# Altium project FEED_TIMER_DP_7.PrjPcb
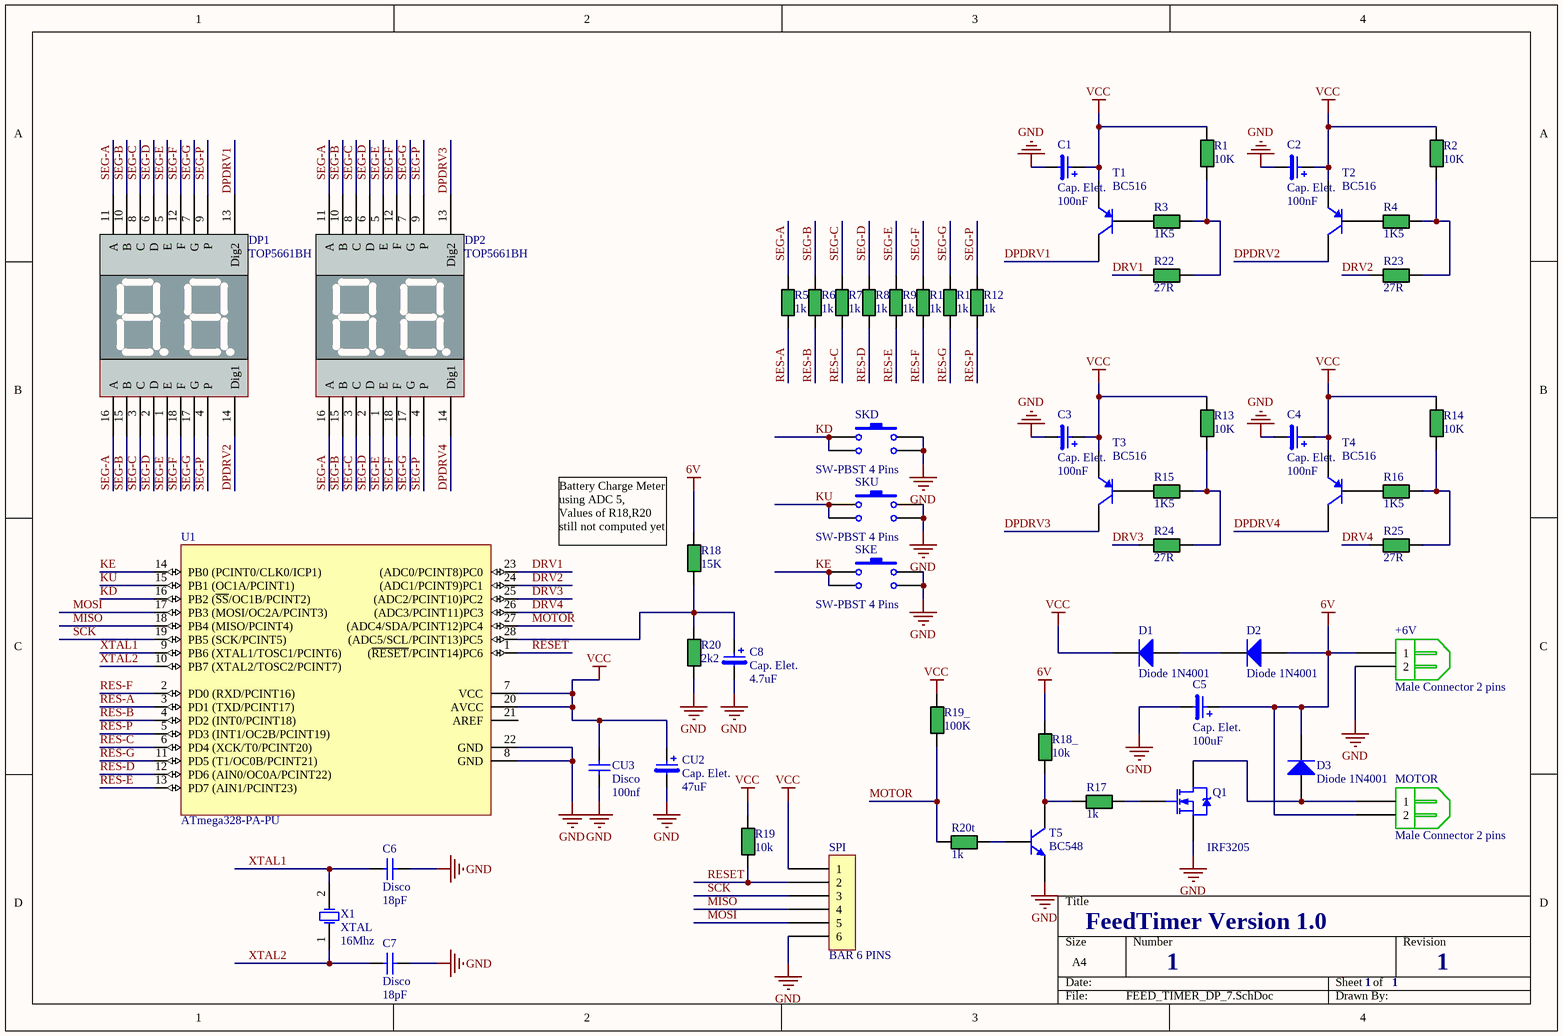
[diagram p0: FEED_TIMER_DP_7.SchDoc]
1 sheet, 56 parts. Net scope: global (net labels, ports and power ports of the same name join across sheets).
Board file: FEDD_TIMER_DP_7.PcbDoc

## Sheet FEED_TIMER_DP_7.SchDoc: Feed Timer DP-7
size A4; Organization: João D. A. Oliveira; DocumentNumber: 1; Revision: 1; PageSetup: Record=PageOptions|CenterHorizontal=True|CenterVertical=True|PrintScale=1.00|XCorrection=1.00|YCorrection=1.00|PrintKind=0|BorderSize=5000000|LeftOffset=0|BottomOffset=0|Orientation=2|PaperLength=1000|PaperWidth=1000|Scale=100|PaperSource=7|PrintQuality=-3|MediaType=1|DitherType=10|PrintScaleMode=1|PaperKind=A4|PaperIndex=9

### Parts
+6V  Male Connector 2 pins  [BR102A]
C1  Cap. Elet.  value 100nF  [CAP ELE RAD 11mm H]
C2  Cap. Elet.  value 100nF  [CAP ELE RAD 11mm H]
C3  Cap. Elet.  value 100nF  [CAP ELE RAD 11mm H]
C4  Cap. Elet.  value 100nF  [CAP ELE RAD 11mm H]
C5  Cap. Elet.  value 100uF  [CAP_RADIAL_2_10_16]
C6  Disco  value 18pF  [CAP CER DISK 3MM]
C7  Disco  value 18pF  [CAP CER DISK 3MM]
C8  Cap. Elet.  value 4.7uF  [CAP ELE RAD 11mm H]
CU2  Cap. Elet.  value 47uF  [CAP ELE RAD 11mm H]
CU3  Disco  value 100nf  [CAP CER DISK 5MM]
D1  Diode 1N4001  [DO-41]
D2  Diode 1N4001  [DO-41]
D3  Diode 1N4001  [DO-41]
DP1  TOP5661BH  [DISPLAY TOP_5261BH]
DP2  TOP5661BH  [DISPLAY TOP_5261BH]
MOTOR  Male Connector 2 pins  [BR102A]
Q1  IRF3205  [KC03 - Deitado]
R1  value 10K  [RES 300 CR25]  (hidden comment: Resistor Generic)
R2  value 10K  [RES 300 CR25]  (hidden comment: Resistor Generic)
R3  value 1K5  [RES 300 CR25]  (hidden comment: Resistor Generic)
R4  value 1K5  [RES 300 CR25]  (hidden comment: Resistor Generic)
R5  value 1k  [RES 300 CR25]  (hidden comment: Resistor Generic)
R6  value 1k  [RES 300 CR25]  (hidden comment: Resistor Generic)
R7  value 1k  [RES 300 CR25]  (hidden comment: Resistor Generic)
R8  value 1k  [RES 300 CR25]  (hidden comment: Resistor Generic)
R9  value 1k  [RES 300 CR25]  (hidden comment: Resistor Generic)
R10  value 1k  [RES 300 CR25]  (hidden comment: Resistor Generic)
R11  value 1k  [RES 300 CR25]  (hidden comment: Resistor Generic)
R12  value 1k  [RES 300 CR25]  (hidden comment: Resistor Generic)
R13  value 10K  [RES 300 CR25]  (hidden comment: Resistor Generic)
R14  value 10K  [RES 300 CR25]  (hidden comment: Resistor Generic)
R15  value 1K5  [RES 300 CR25]  (hidden comment: Resistor Generic)
R16  value 1K5  [RES 300 CR25]  (hidden comment: Resistor Generic)
R17  value 1k  [RES 300 CR25]  (hidden comment: Resistor Generic)
R18  value 15K  [RES 300 CR25]  (hidden comment: Resistor Generic)
R18_  value 10k  [RES 300 CR25]  (hidden comment: Resistor Generic)
R19  value 10k  [RES 300 CR25]  (hidden comment: Resistor Generic)
R19_  value 100K  [RES 300 CR25]  (hidden comment: Resistor Generic)
R20  value 2k2  [RES 300 CR25]  (hidden comment: Resistor Generic)
R20t  value 1k  [RES 300 CR25]  (hidden comment: Resistor Generic)
R22  value 27R  [RES 300 CR25]  (hidden comment: Resistor Generic)
R23  value 27R  [RES 300 CR25]  (hidden comment: Resistor Generic)
R24  value 27R  [RES 300 CR25]  (hidden comment: Resistor Generic)
R25  value 27R  [RES 300 CR25]  (hidden comment: Resistor Generic)
SKD  SW-PBST 4 Pins  [SW-PBST 4 Pins - SKHH 17 mm]
SKE  SW-PBST 4 Pins  [SW-PBST 4 Pins - SKHH 17 mm]
SKU  SW-PBST 4 Pins  [SW-PBST 4 Pins - SKHH 17 mm]
SPI  BAR 6 PINS  [HEADER BAR 6 PINS]
T1  BC516  [TO-92 - Large]
T2  BC516  [TO-92]
T3  BC516  [TO-92]
T4  BC516  [TO-92]
T5  value BC548  [TO-92 - BIG]  (hidden comment: Transistor)
U1  ATmega328-PA-PU  [28P3]
X1  XTAL  value 16Mhz  [XTAL CILINDRIC DEITADO]

### Nets
6V: +6V.1 C5.1 D2.1(A) D3.2(K) MOTOR.2 R18.2 R18_.2
GND: +6V.2 C1.2 C2.2 C3.2 C4.2 C5.2 C6.2 C7.2 C8.2 CU2.2 CU3.2 Q1.3(S) R20.1 SKD.1 SKD.2 SKE.1 SKE.2 SKU.1 SKU.2 SPI.6 T5.1(E) U1.8(GND) U1.22(GND)
VCC: C1.1 C2.1 C3.1 C4.1 CU2.1 CU3.1 D1.2(K) R1.2 R2.2 R13.2 R14.2 R19.2 R19_.2 SPI.1 T1.1(E) T2.1(E) T3.1(E) T4.1(E) U1.7(VCC) U1.20(AVCC)
DPDRV1: DP1.13(Dig2) T1.3(C)
DPDRV2: DP1.14(Dig1) T2.3(C)
DPDRV3: DP2.13(Dig2) T3.3(C)
DPDRV4: DP2.14(Dig1) T4.3(C)
DRV1: R22.1 U1.23((ADC0/PCINT8)PC0)
DRV2: R23.1 U1.24((ADC1/PCINT9)PC1)
DRV3: R24.1 U1.25((ADC2/PCINT10)PC2)
DRV4: R25.1 U1.26((ADC3/PCINT11)PC3)
KD: SKD.3 SKD.4 U1.16(PB2_(~{SS}/OC1B/PCINT2))
KE: SKE.3 SKE.4 U1.14(PB0_(PCINT0/CLK0/ICP1))
KU: SKU.3 SKU.4 U1.15(PB1_(OC1A/PCINT1))
MISO: SPI.4 U1.18(PB4_(MISO/PCINT4))
MOSI: SPI.5 U1.17(PB3_(MOSI/OC2A/PCINT3))
MOTOR: R19_.1 R20t.1 U1.27((ADC4/SDA/PCINT12)PC4)
RES-A: R5.2 U1.3(PD1_(TXD/PCINT17))
RES-B: R6.2 U1.4(PD2_(INT0/PCINT18))
RES-C: R7.2 U1.6(PD4_(XCK/T0/PCINT20))
RES-D: R8.2 U1.12(PD6_(AIN0/OC0A/PCINT22))
RES-E: R9.2 U1.13(PD7_(AIN1/PCINT23))
RES-F: R10.2 U1.2(PD0_(RXD/PCINT16))
RES-G: R11.2 U1.11(PD5_(T1/OC0B/PCINT21))
RES-P: R12.2 U1.5(PD3_(INT1/OC2B/PCINT19))
RESET: R19.1 SPI.2 U1.1((~{RESET}/PCINT14)PC6)
SCK: SPI.3 U1.19(PB5_(SCK/PCINT5))
SEG-A: DP1.11(A) DP1.16(A) DP2.11(A) DP2.16(A) R5.1
SEG-B: DP1.10(B) DP1.15(B) DP2.10(B) DP2.15(B) R6.1
SEG-C: DP1.3(C) DP1.8(C) DP2.3(C) DP2.8(C) R7.1
SEG-D: DP1.2(D) DP1.6(D) DP2.2(D) DP2.6(D) R8.1
SEG-E: DP1.1(E) DP1.5(E) DP2.1(E) DP2.5(E) R9.1
SEG-F: DP1.12(F) DP1.18(F) DP2.12(F) DP2.18(F) R10.1
SEG-G: DP1.7(G) DP1.17(G) DP2.7(G) DP2.17(G) R11.1
SEG-P: DP1.4(P) DP1.9(P) DP2.4(P) DP2.9(P) R12.1
XTAL1: C6.1 U1.9(PB6_(XTAL1/TOSC1/PCINT6)) X1.2(OSC2)
XTAL2: C7.1 U1.10(PB7_(XTAL2/TOSC2/PCINT7)) X1.1(OSC1)
NetC8_1: C8.1 R18.1 R20.2 U1.28((ADC5/SCL/PCINT13)PC5)
NetD1_1: D1.1(A) D2.2(K)
NetD3_1: D3.1(A) MOTOR.1 Q1.2(D)
NetQ1_1: Q1.1(G) R17.2
NetR1_1: R1.1 R3.2 R22.2
NetR2_1: R2.1 R4.2 R23.2
NetR3_1: R3.1 T1.2(B)
NetR4_1: R4.1 T2.2(B)
NetR13_1: R13.1 R15.2 R24.2
NetR14_1: R14.1 R16.2 R25.2
NetR15_1: R15.1 T3.2(B)
NetR16_1: R16.1 T4.2(B)
NetR17_1: R17.1 R18_.1 T5.3(C)
NetR20t_2: R20t.2 T5.2(B)

Not connected (* = marked no-connect by the designer): U1 21(AREF)

### Notes on the sheet
- (near R18) Battery Charge Meter using ADC 5,
  Values of R18,R20 still not computed yet
- FeedTimer Version 1.0
- 1
- 1       1
- Title
- Size:
- Date:
- A4
- Number:
- Time:
- Revision:
- Sheet
- of
- File:

### Library data of the parts
+6V MOTOR = Male Con 2 Pin
C1-C5 C8 CU2 = CAP_RADIAL_ELETROLITICO: Capacitor Radial Eletrolitico
C6 C7 CU3 = CAP_DISCO: SMD Capacitor 1210 size
D1-D3 = Diode 1N4001: 1 Amp General Purpose Rectifier; Published: 8-Jun-2000; LatestRevisionDate: 17-Jul-2002; LatestRevisionNote: Re-released for DXP Platform.; DatasheetDocument: 1998; PackageDocument: Aug-1999; PackageReference: DO-41; Publisher: Altium Limited; Code_JEDEC: DO-204-AL; ComponentLink1Description: Manufacturer Link; ComponentLink1URL: http://www.fairchildsemi.com/; ComponentLink2Description: Datasheet; ComponentLink2URL: http://www.fairchildsemi.com/ds/1N%2F1N4001.pdf
DP1 DP2 = DISPLAY TOP_5261BH: 7 seg display
Q1 = T-HEXFET N: HEXFET Power MOSFET
R1-R18 R18_ R19 R19_ R20 R20t R22-R25 = Resistor Generic: Generic Resistor
SKD SKE SKU = SW-PBST 4 Pins SKHH: Published: 24-Mar-1999; LatestRevisionDate: 17-Jul-2002; LatestRevisionNote: Re-released for DXP Platform.; PackageReference: SPST-2; Publisher: Altium Limited
SPI = HEADER BAR  6 PINS: .100 Inch AMPMODU Headers 1-826629-0 (Tyco)
T1-T4 = T-PNP: General Bipolar Transistor NPN
T5 = T-NPN: General Bipolar Transistor NPN
U1 = ATmega328-PA-PU: 8-Bit AVR Microcontroller with 8K Bytes of In-System Programmable Flash Memory
X1 = XTAL: Crystal Oscillator